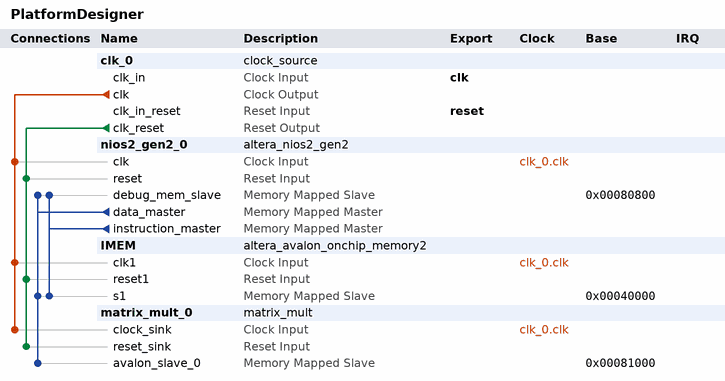
[diagram p0: system contents]
# Platform Designer (Qsys) system PlatformDesigner, Cyclone V 5CSXFC6D6F31C6
# Parameters at their usual value, and those the tool derives, are not listed.
package require -exact qsys 18.1
create_system PlatformDesigner
set_project_property DEVICE_FAMILY {Cyclone V}
set_project_property DEVICE 5CSXFC6D6F31C6

add_instance clk_0 clock_source 18.1
set_instance_parameter_value clk_0 clockFrequency 50000000

add_instance nios2_gen2_0 altera_nios2_gen2 18.1
set_instance_parameter_value nios2_gen2_0 dcache_size 2048
set_instance_parameter_value nios2_gen2_0 exceptionSlave IMEM.s1
set_instance_parameter_value nios2_gen2_0 icache_size 4096
set_instance_parameter_value nios2_gen2_0 impl Fast
set_instance_parameter_value nios2_gen2_0 resetSlave IMEM.s1

add_instance IMEM altera_avalon_onchip_memory2 18.1
set_instance_parameter_value IMEM dataWidth 32
set_instance_parameter_value IMEM dualPort false
set_instance_parameter_value IMEM initMemContent true
set_instance_parameter_value IMEM initializationFileName onchip_mem.hex
set_instance_parameter_value IMEM memorySize 204800

add_instance matrix_mult_0 matrix_mult 1.0

# connections
add_connection clk_0.clk IMEM.clk1 clock
add_connection clk_0.clk matrix_mult_0.clock_sink clock
add_connection clk_0.clk nios2_gen2_0.clk clock
add_connection clk_0.clk_reset IMEM.reset1 reset
add_connection clk_0.clk_reset matrix_mult_0.reset_sink reset
add_connection clk_0.clk_reset nios2_gen2_0.reset reset
add_connection nios2_gen2_0.data_master IMEM.s1 avalon
set_connection_parameter_value nios2_gen2_0.data_master/IMEM.s1 baseAddress 0x00040000
add_connection nios2_gen2_0.data_master matrix_mult_0.avalon_slave_0 avalon
set_connection_parameter_value nios2_gen2_0.data_master/matrix_mult_0.avalon_slave_0 baseAddress 0x00081000
add_connection nios2_gen2_0.data_master nios2_gen2_0.debug_mem_slave avalon
set_connection_parameter_value nios2_gen2_0.data_master/nios2_gen2_0.debug_mem_slave baseAddress 0x00080800
add_connection nios2_gen2_0.instruction_master IMEM.s1 avalon
set_connection_parameter_value nios2_gen2_0.instruction_master/IMEM.s1 baseAddress 0x00040000
add_connection nios2_gen2_0.instruction_master nios2_gen2_0.debug_mem_slave avalon
set_connection_parameter_value nios2_gen2_0.instruction_master/nios2_gen2_0.debug_mem_slave baseAddress 0x00080800

# exported interfaces
add_interface clk clock sink
set_interface_property clk EXPORT_OF clk_0.clk_in
add_interface reset reset sink
set_interface_property reset EXPORT_OF clk_0.clk_in_reset

set_interconnect_requirement {$system} qsys_mm.clockCrossingAdapter HANDSHAKE
set_interconnect_requirement {$system} qsys_mm.enableEccProtection FALSE
set_interconnect_requirement {$system} qsys_mm.insertDefaultSlave FALSE
set_interconnect_requirement {$system} qsys_mm.maxAdditionalLatency 1

save_system PlatformDesigner.qsys
